# EAGLE design eZ-FET lite (EAGLE 6.4)

## Sheet 1 of 2
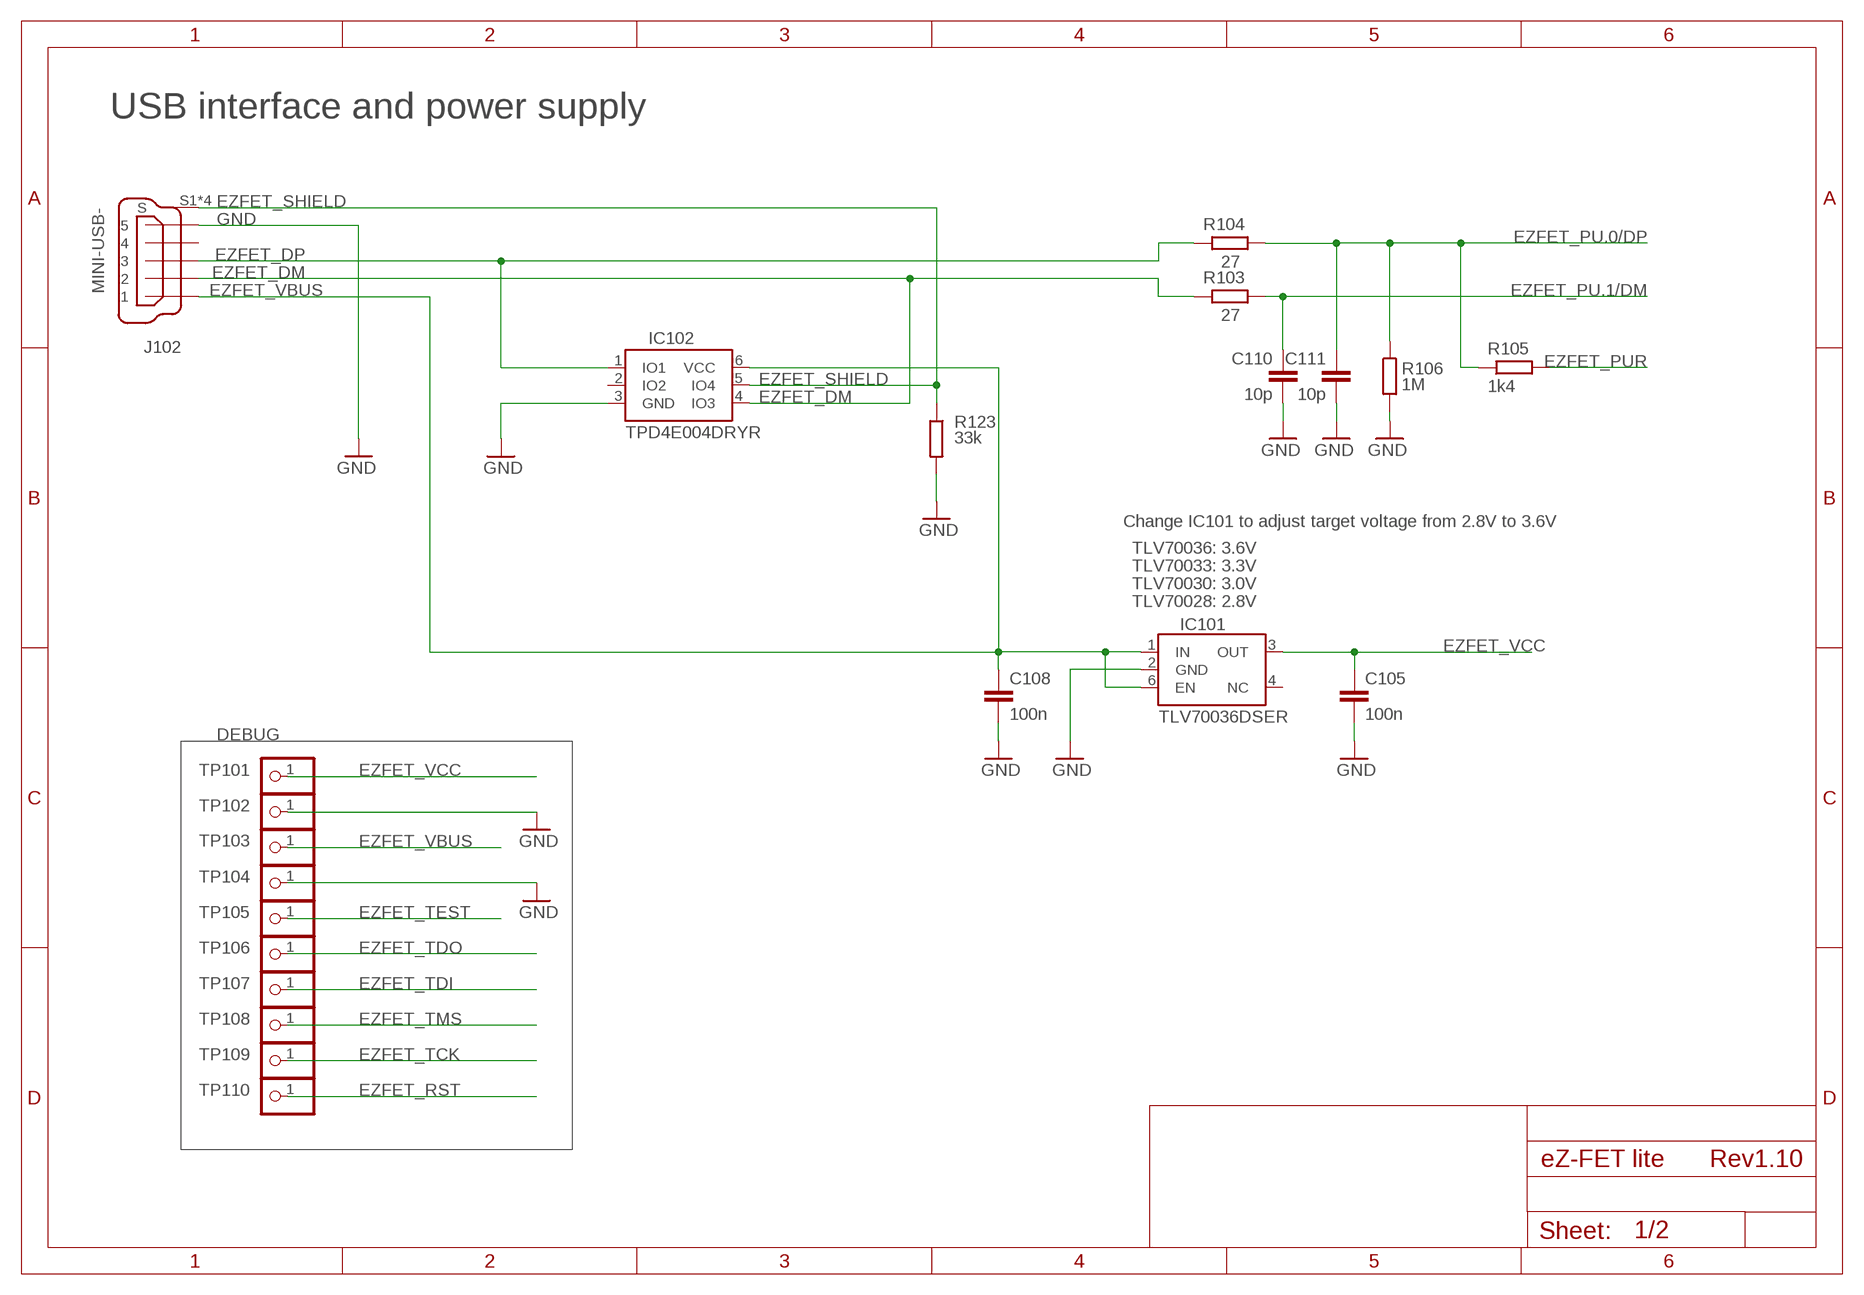
[diagram p0: schematic, sheet 1]

### Parts
C105  100n  C-EUC0402  [C0402]
C108  100n  C-EUC0402  [C0402]
C110  10p  C-EUC0402  [C0402]
C111  10p  C-EUC0402  [C0402]
IC101  TLV70036DSER  TLV700XX  [SON(DRY)6]
IC102  TPD4E004DRYR  TPD4E004  [SON(DRY)6]
J102  MINI-USB-  [UX62M-B-5P]
R103  27  R-EU_R0402  [R0402]
R104  27  R-EU_R0402  [R0402]
R105  1k4  R-EU_R0402  [R0402]
R106  1M  R-EU_R0402  [R0402]
R123  33k  R-EU_R0402  [R0402]
TP101  TEST_PIN2  PINHD-1X1  [1X01]
TP102  TEST_PIN2  PINHD-1X1  [1X01]
TP103  TEST_PIN2  PINHD-1X1  [1X01]
TP104  TEST_PIN2  PINHD-1X1  [1X01]
TP105  TEST_PIN2  PINHD-1X1  [1X01]
TP106  TEST_PIN2  PINHD-1X1  [1X01]
TP107  TEST_PIN2  PINHD-1X1  [1X01]
TP108  TEST_PIN2  PINHD-1X1  [1X01]
TP109  TEST_PIN2  PINHD-1X1  [1X01]
TP110  TEST_PIN2  PINHD-1X1  [1X01]

### Nets
EZFET_DM: IC102.4(IO3) J102.2 R103.1
EZFET_DP: IC102.1(IO1) J102.3 R104.1
EZFET_PU.0/DP: C111.1 R104.2 R105.1 R106.1 ; also sheet 2
EZFET_PU.1/DM: C110.1 R103.2 ; also sheet 2
EZFET_PUR: R105.2 ; also sheet 2
EZFET_RST: TP110.1 ; also sheet 2
EZFET_SHIELD: IC102.5(IO4) J102.S1(S) J102.S2(S) J102.S3(S) J102.S4(S) R123.1
EZFET_TCK: TP109.1 ; also sheet 2
EZFET_TDI: TP107.1 ; also sheet 2
EZFET_TDO: TP106.1 ; also sheet 2
EZFET_TEST: TP105.1 ; also sheet 2
EZFET_TMS: TP108.1 ; also sheet 2
EZFET_VBUS: C108.1 IC101.1(IN) IC101.6(EN) IC102.6(VCC) J102.1 TP103.1 ; also sheet 2
EZFET_VCC: C105.1 IC101.3(OUT) TP101.1 ; also sheet 2
GND: C105.2 C108.2 C110.2 C111.2 IC101.2(GND) IC102.3(GND) J102.5 R106.2 R123.2 TP102.1 TP104.1 ; also sheet 2
Unconnected: IC101.4(NC) IC102.2(IO2) J102.4

### Notes on the sheet
- USB interface and power supply
- Change IC101 to adjust target voltage from 2.8V to 3.6V
- TLV70036: 3.6V
- TLV70033: 3.3V
- TLV70030: 3.0V
- TLV70028: 2.8V
- DEBUG
- Rev1.10

## Sheet 2 of 2
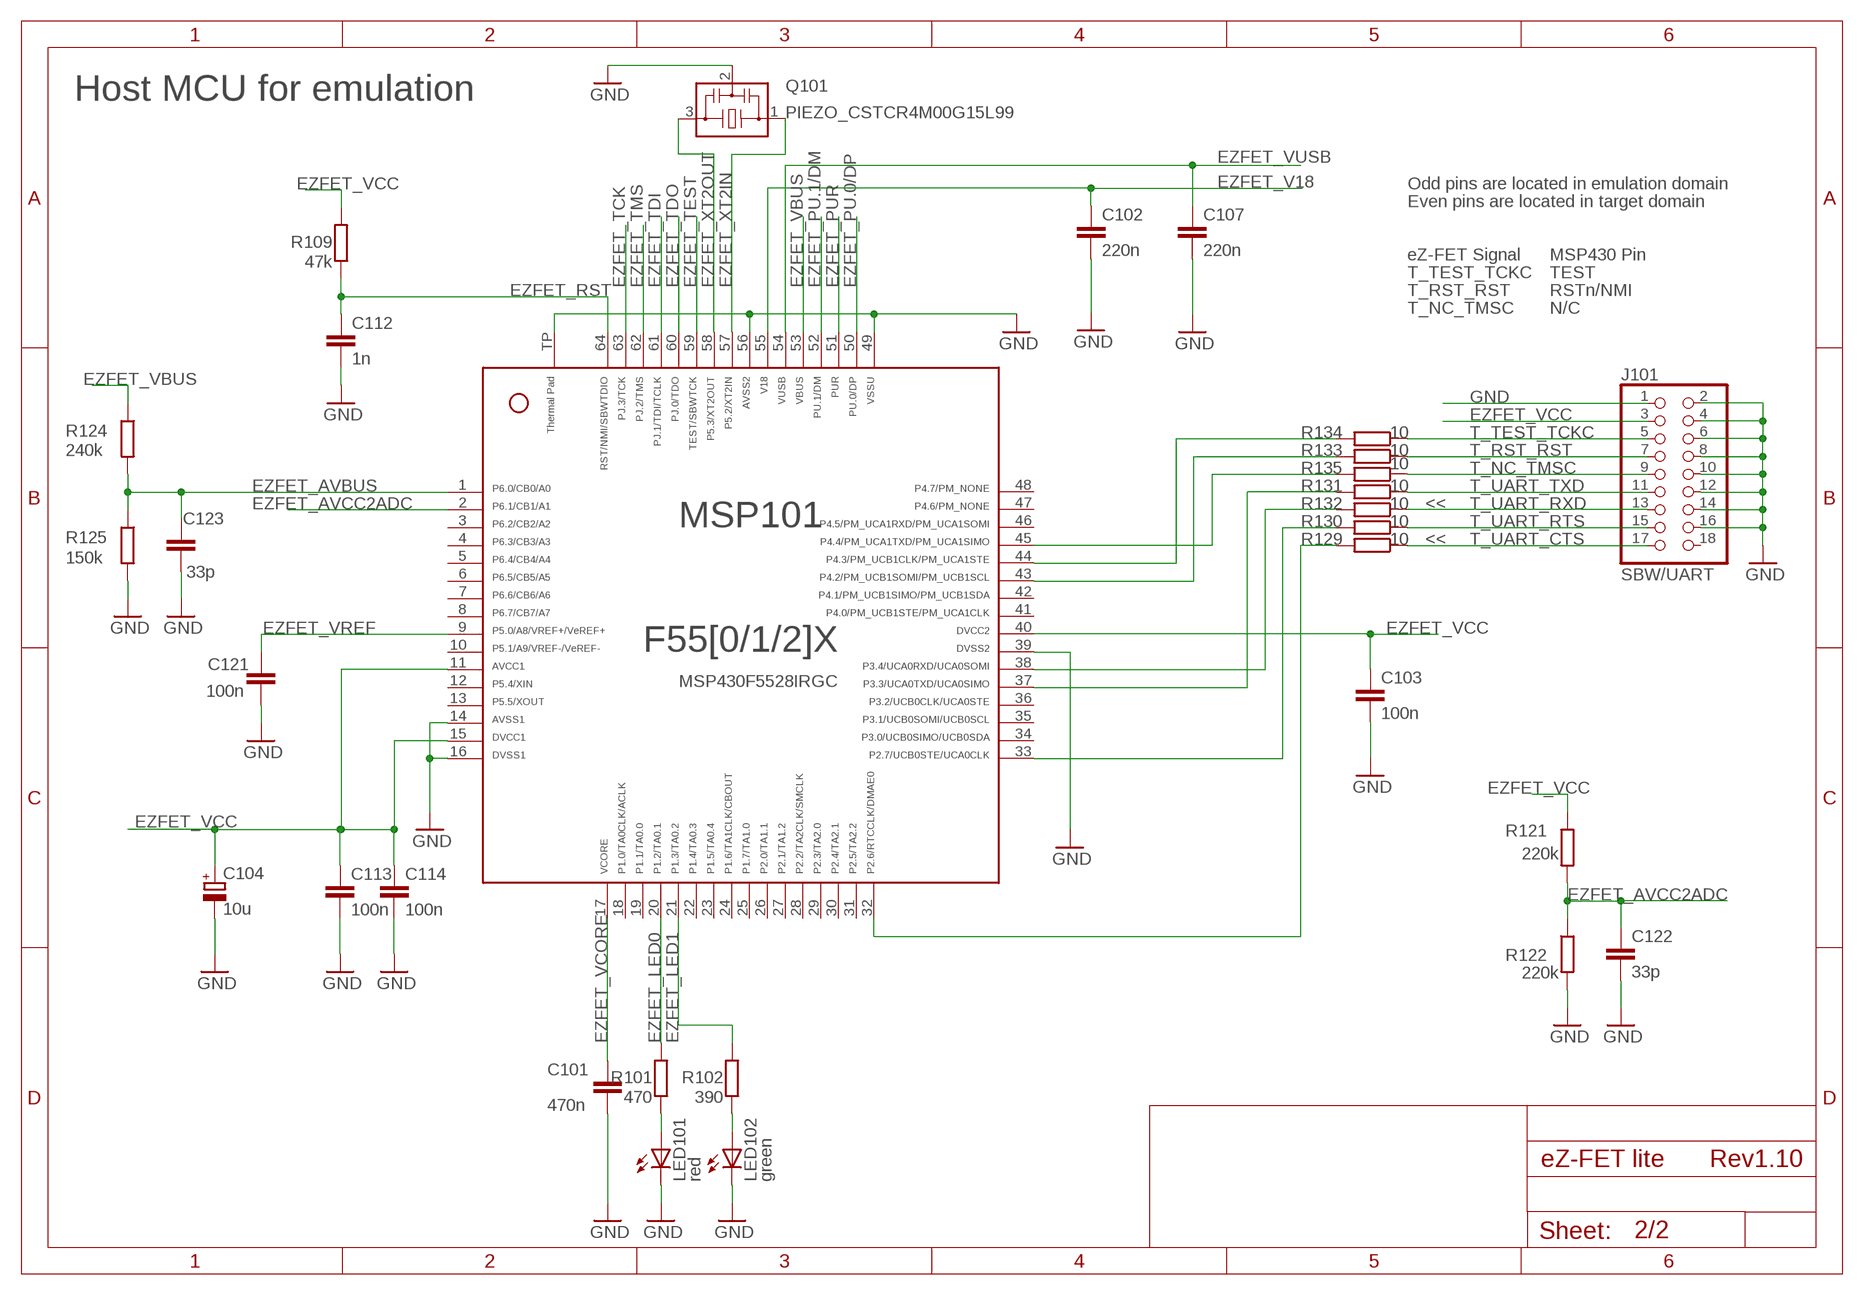
[diagram p1: schematic, sheet 2]

### Parts
C101  470n  C-EUC0402  [C0402]
C102  220n  C-EUC0402  [C0402]
C103  100n  C-EUC0402  [C0402]
C104  10u  CPOL-EUA/3216-18R  [A/3216-18R]
C107  220n  C-EUC0402  [C0402]
C112  1n  C-EUC0402  [C0402]
C113  100n  C-EUC0402  [C0402]
C114  100n  C-EUC0402  [C0402]
C121  100n  C-EUC0402  [C0402]
C122  33p  C-EUC0402  [C0402]
C123  33p  C-EUC0402  [C0402]
J101  SBW/UART  PINHD-2X9  [2X09]
LED101  red  LEDCHIP-LED0603  [CHIP-LED0603]
LED102  green  LEDCHIP-LED0603  [CHIP-LED0603]
MSP101  MSP430F5528IRGC  F55[0/1/2]X---RGC64  [RGC64]
Q101  PIEZO_CSTCR4M00G15L99  CSTCR6M00G53Z  [CSTCR6M]
R101  470  R-EU_R0402  [R0402]
R102  390  R-EU_R0402  [R0402]
R109  47k  R-EU_R0402  [R0402]
R121  220k  R-EU_R0402  [R0402]
R122  220k  R-EU_R0402  [R0402]
R124  240k  R-EU_R0402  [R0402]
R125  150k  R-EU_R0402  [R0402]
R129  10  R-EU_R0402  [R0402]
R130  10  R-EU_R0402  [R0402]
R131  10  R-EU_R0402  [R0402]
R132  10  R-EU_R0402  [R0402]
R133  10  R-EU_R0402  [R0402]
R134  10  R-EU_R0402  [R0402]
R135  10  R-EU_R0402  [R0402]

### Nets
EZFET_AVBUS: C123.2 MSP101.1 R124.2 R125.1
EZFET_AVCC2ADC: C122.2 MSP101.2 R121.2 R122.1
EZFET_LED0: MSP101.20 R101.2
EZFET_LED1: MSP101.21 R102.2
EZFET_PU.0/DP: MSP101.50 ; also sheet 1
EZFET_PU.1/DM: MSP101.52 ; also sheet 1
EZFET_PUR: MSP101.51 ; also sheet 1
EZFET_RST: C112.1 MSP101.64 R109.1 ; also sheet 1
EZFET_SBWTCK: MSP101.44 R134.2
EZFET_SBWTDIO: MSP101.43 R133.2
EZFET_TCK: MSP101.63 ; also sheet 1
EZFET_TDI: MSP101.61 ; also sheet 1
EZFET_TDO: MSP101.60 ; also sheet 1
EZFET_TEST: MSP101.59 ; also sheet 1
EZFET_TMS: MSP101.62 ; also sheet 1
EZFET_UARTCTS: MSP101.32 R129.2
EZFET_UARTRTS: MSP101.33 R130.2
EZFET_UARTRXD: MSP101.38 R132.2
EZFET_UARTTXD: MSP101.37 R131.2
EZFET_V18: C102.1 MSP101.55
EZFET_VBUS: MSP101.53 R124.1 ; also sheet 1
EZFET_VCC: C103.1 C104.+ C113.1 C114.1 J101.3 MSP101.11 MSP101.15 MSP101.40 R109.2 R121.1 ; also sheet 1
EZFET_VCORE: C101.1 MSP101.17
EZFET_VREF: C121.1 MSP101.9
EZFET_VUSB: C107.1 MSP101.54
EZFET_XT2IN: MSP101.57 Q101.1
EZFET_XT2OUT: MSP101.58 Q101.3
GND: C101.2 C102.2 C103.2 C104.- C107.2 C112.2 C113.2 C114.2 C121.2 C122.1 C123.1 J101.1 J101.2 J101.4 J101.6 J101.8 J101.10 J101.12 J101.14 J101.16 LED101.C LED102.C MSP101.14 MSP101.16 MSP101.39 MSP101.49 MSP101.56 MSP101.TP Q101.2 R122.2 R125.2 ; also sheet 1
N$1: LED101.A R101.1
N$2: LED102.A R102.1
N$3: MSP101.45 R135.2
T_NC_TMSC: J101.9 R135.1
T_RST_RST: J101.7 R133.1
T_TEST_TCKC: J101.5 R134.1
T_UART_CTS: J101.17 R129.1
T_UART_RTS: J101.15 R130.1
T_UART_RXD: J101.13 R132.1
T_UART_TXD: J101.11 R131.1
Unconnected: J101.18 MSP101.3 MSP101.4 MSP101.5 MSP101.6 MSP101.7 MSP101.8 MSP101.10 MSP101.12 MSP101.13 MSP101.18 MSP101.19 MSP101.22 MSP101.23 MSP101.24 MSP101.25 MSP101.26 MSP101.27 MSP101.28 MSP101.29 MSP101.30 MSP101.31 MSP101.34 MSP101.35 MSP101.36 MSP101.41 MSP101.42 MSP101.46 MSP101.47 MSP101.48

### Notes on the sheet
- Host MCU for emulation
- Odd pins are located in emulation domain
- Even pins are located in target domain
- eZ-FET Signal | MSP430 Pin
- T_TEST_TCKC | TEST
- T_RST_RST | RSTn/NMI
- T_NC_TMSC | N/C
- <<
- <<
- MSP430F5528IRGC
- Rev1.10

## Library data of the parts
C101-C103 C105 C107 C108 C110-C114 C121-C123 = rcl:C-EU: CAPACITOR, European symbol
C104 = rcl:CPOL-EU: POLARIZED CAPACITOR, European symbol
IC101 = eZFET:TLV700XX
IC102 = eZFET:TPD4E004
J101 = pinhead:PINHD-2X9: PIN HEADER
J102 = eZFET:MINI-USB-: MINI USB Connector Source: http://www.hirose.co.jp/cataloge_hp/e24000019.pdf
LED101 LED102 = led:LED: LED OSRAM: - CHIPLED LG R971, LG N971, LY N971, LG Q971, LY Q971, LO R971, LY R971 LH N974, LH R974 LS Q976, LO Q976, LY Q976 LO Q996 - Hyper CHIPLED LW Q18S LB Q993, LB Q99A, LB R99A - SideLED LS A670, LO A670, LY A670, LG A670, LP A670 LB A673, LV A673, LT A673, LW A673 LH A674 LY A675 LS A676, LA A676, LO A676, LY A676, LW A676 LS A679, LY A679, LG A679 - Hyper Micro SIDELED® LS Y876, LA Y876, LO Y876, LY Y876 LT Y87S - SmartLED LW L88C, LW L88S LB L89C, LB L89S, LG L890 LS L89K, LO L89K, LY L89K LS L896, LA L896, LO L896, LY L896 - TOPLED LS T670, LO T670, LY T670, LG T670, LP T670 LSG T670, LSP T670, LSY T670, LOP T670, LYG T670 LG T671, LOG T671, LSG T671 LB T673, LV T673, LT T673, LW T673 LH T674 LS T676, LA T676, LO T676, LY T676, LB T676, LH T676, LSB T676, LW T676 LB T67C, LV T67C, LT T67C, LS T67K, LO T67K, LY T67K, LW E67C LS E67B, LA E67B, LO E67B, LY E67B, LB E67C, LV E67C, LT E67C LW T67C LS T679, LY T679, LG T679 LS T770, LO T770, LY T770, LG T770, LP T770 LB T773, LV T773, LT T773, LW T773 LH T774 LS E675, LA E675, LY E675, LS T675 LS T776, LA T776, LO T776, LY T776, LB T776 LHGB T686 LT T68C, LB T68C - Hyper Mini TOPLED® LB M676 - Mini TOPLED Santana® LG M470 LS M47K, LO M47K, LY M47K Source: http://www.osram.convergy.de LUXEON: - LUMILED® LXK2-PW12-R00, LXK2-PW12-S00, LXK2-PW14-U00, LXK2-PW14-V00 LXK2-PM12-R00, LXK2-PM12-S00, LXK2-PM14-U00 LXK2-PE12-Q00, LXK2-PE12-R00, LXK2-PE12-S00, LXK2-PE14-T00, LXK2-PE14-U00 LXK2-PB12-K00, LXK2-PB12-L00, LXK2-PB12-M00, LXK2-PB14-N00, LXK2-PB14-P00, LXK2-PB14-Q00 LXK2-PR12-L00, LXK2-PR12-M00, LXK2-PR14-Q00, LXK2-PR14-R00 LXK2-PD12-Q00, LXK2-PD12-R00, LXK2-PD12-S00 LXK2-PH12-R00, LXK2-PH12-S00 LXK2-PL12-P00, LXK2-PL12-Q00, LXK2-PL12-R00 Source: www.luxeon.com KINGBRIGHT: KA-3528ASYC Source: www.kingbright.com
MSP101 = TI_MSP430_v16:F55[0/1/2]X---RGC64: ***F55[0/1/2]X***RGC64 Rev. 1.0 06/2010 "http://www.ti.com/lit/gpn/msp430f5529" "http://www.ti.com/lit/gpn/msp430f5509" F5513/F5514 with limited Functions on some Pins
Q101 = murata-filter:CSTCR: Resonator Source: murata.co.jp; MPN: CSTCR6M00G53-R0; OC_FARNELL: 1170434; OC_NEWARK: 25M8759
R101-R106 R109 R121-R125 R129-R135 = rcl:R-EU_: RESISTOR, European symbol
TP101-TP110 = pinhead:PINHD-1X1: PIN HEADER

## Board
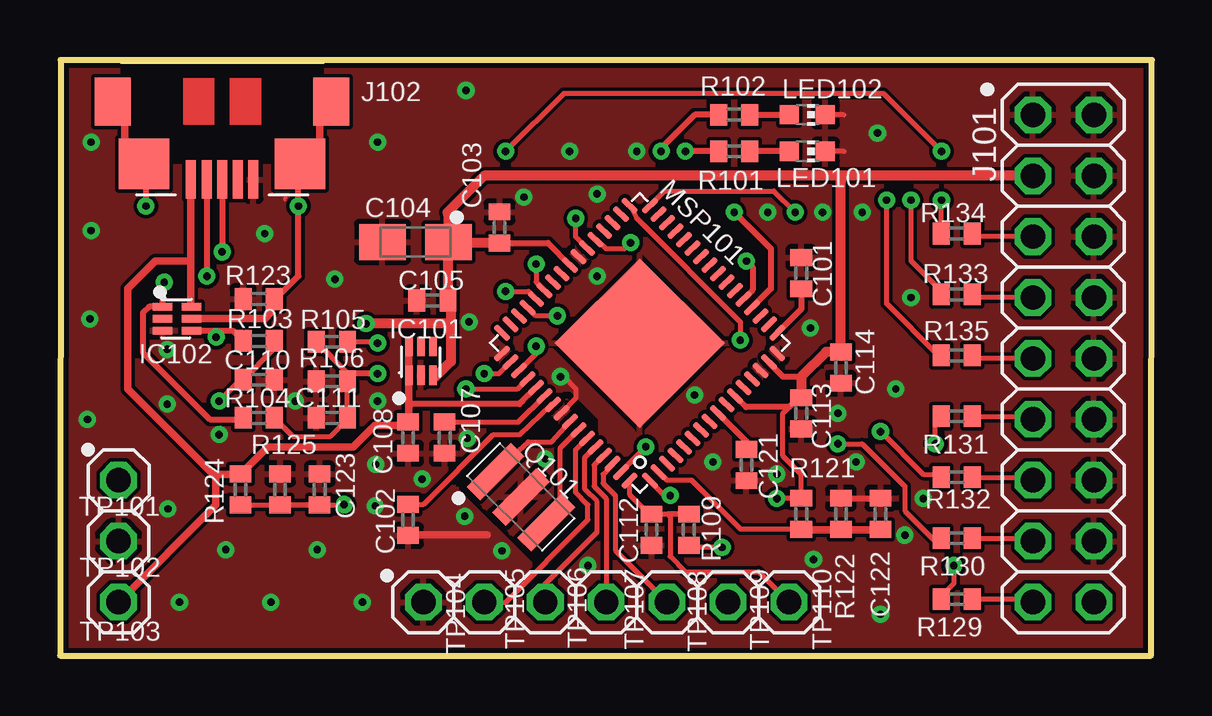
[diagram p2: board, top side]
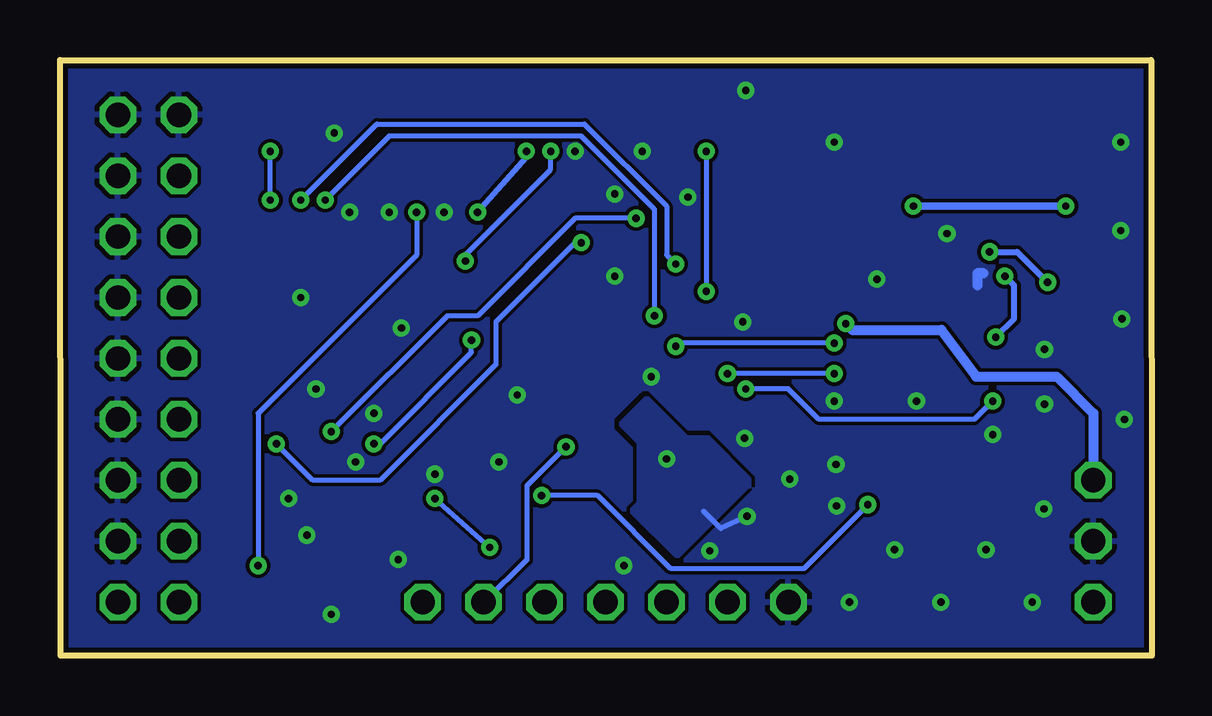
[diagram p3: board, bottom side, seen from below]

Size 45.49 x 24.84 mm. Coordinates in mm from the lower left corner, seen from the top.
Outline: 0,0 45.47,0 45.49,24.84 0.03,24.84 0,0
Copper layers (1*16): Top 0.0178mm / dielectric 12mil / Bottom 0.0178mm
Design rules "default": minimum track width 6mil, minimum drill 12mil, track to track 6mil, track to pad 6mil, pad to pad 6mil, via to via 8mil, smd to smd 6mil, copper to edge 8mil, drill to drill 8mil, minimum pad ring 10mil, minimum via ring 8mil, stop-mask expansion 8mil, vias tented up to drill 15mil, thermal gap 8mil
tRestrict: area 16.5,3.9 to 22.4,11
bRestrict: area 16.5,3.9 to 22.4,11

### Footprints (pad centres in the part's own frame; a part is rotated, then mirrored left to right if it is on the bottom)
C0402 = smd 0.7 x 0.9: 1 -0.65,0; 2 0.65,0
A/3216-18R = smd 1.95 x 1.5: + 1.375,0; - -1.375,0
SON(DRY)6 = smd 0.81 x 0.305: 1 -0.1,0; 2 -0.1,-0.5; 3 -0.1,-1; 4 1.1,-1; 5 1.1,-0.5; 6 1.1,0
2X09 = drill 1.016 octagon: 1 -10.16,-1.27; 2 -10.16,1.27; 3 -7.62,-1.27; 4 -7.62,1.27; 5 -5.08,-1.27; 6 -5.08,1.27; 7 -2.54,-1.27; 8 -2.54,1.27; 9 0,-1.27; 10 0,1.27; 11 2.54,-1.27; 12 2.54,1.27; 13 5.08,-1.27; 14 5.08,1.27; 15 7.62,-1.27; 16 7.62,1.27; 17 10.16,-1.27; 18 10.16,1.27
UX62M-B-5P = smd 0.42 x 1.6: 1 1.3,1.3; 2 0.65,1.3; 3 0,1.3; 4 -0.65,1.3; 5 -1.3,1.3 | smd 2.1 x 2.1: S1 -3.25,0.65; S2 3.25,0.65 | smd 1.5 x 2: S3 -4.55,-1.95; S4 4.55,-1.95
CHIP-LED0603 = smd 0.8 x 0.8: A 0,-0.75; C 0,0.75
RGC64 = smd 0.825 x 0.28: 1 -4.36,3.75; 2 -4.36,3.25; 3 -4.36,2.75; 4 -4.36,2.25; 5 -4.36,1.75; 6 -4.36,1.25; 7 -4.36,0.75; 8 -4.36,0.25; 9 -4.36,-0.25; 10 -4.36,-0.75; 11 -4.36,-1.25; 12 -4.36,-1.75; 13 -4.36,-2.25; 14 -4.36,-2.75; 15 -4.36,-3.25; 16 -4.36,-3.75; 33 4.36,-3.75; 34 4.36,-3.25; 35 4.36,-2.75; 36 4.36,-2.25; 37 4.36,-1.75; 38 4.36,-1.25; 39 4.36,-0.75; 40 4.36,-0.25; 41 4.36,0.25; 42 4.36,0.75; 43 4.36,1.25; 44 4.36,1.75; 45 4.36,2.25; 46 4.36,2.75; 47 4.36,3.25; 48 4.36,3.75 | smd 0.28 x 0.825: 17 -3.75,-4.36; 18 -3.25,-4.36; 19 -2.75,-4.36; 20 -2.25,-4.36; 21 -1.75,-4.36; 22 -1.25,-4.36; 23 -0.75,-4.36; 24 -0.25,-4.36; 25 0.25,-4.36; 26 0.75,-4.36; 27 1.25,-4.36; 28 1.75,-4.36; 29 2.25,-4.36; 30 2.75,-4.36; 31 3.25,-4.36; 32 3.75,-4.36; 49 3.75,4.36; 50 3.25,4.36; 51 2.75,4.36; 52 2.25,4.36; 53 1.75,4.36; 54 1.25,4.36; 55 0.75,4.36; 56 0.25,4.36; 57 -0.25,4.36; 58 -0.75,4.36; 59 -1.25,4.36; 60 -1.75,4.36; 61 -2.25,4.36; 62 -2.75,4.36; 63 -3.25,4.36; 64 -3.75,4.36 | smd 5 x 5: TP 0,0
CSTCR6M = smd 0.8 x 2.6: 1 -1.5,0; 2 0,0; 3 1.5,0
R0402 = smd 0.7 x 0.9: 1 -0.65,0; 2 0.65,0
1X01 = drill 1.016 octagon: 1 0,0

### Placement (x,y rotation side)
C101  30.89,15.95 90 top
C102  14.5,5.66 270 top
C103  18.31,17.86 90 top
C104  14.81,17.25 0 top
C105  15.52,14.81 180 top
C107  16.03,9.09 270 top
C108  14.5,9.09 270 top
C110  8.28,11.51 0 top
C111  11.33,9.92 180 top
C112  24.65,5.25 270 top
C113  30.89,10.11 270 top
C114  32.54,12.01 270 top
C121  28.6,7.95 270 top
C122  34.19,5.92 270 top
C123  10.82,6.93 270 top
IC101  14.54,11.79 90 top
IC102  4.38,14.55 0 top
J101  41.81,12.4 270 top
J102  6.76,21.16 180 top
LED101  31.14,21.03 270 top
LED102  31.14,22.56 270 top
MSP101  24.16,13.03 135 top
Q101  19.2,6.62 315 top
R101  28.09,21.03 180 top
R102  28.09,22.56 180 top
R103  8.28,13.13 0 top
R104  8.28,9.92 0 top
R105  11.33,13.09 0 top
R106  11.33,11.44 180 top
R109  26.2,5.25 270 top
R121  30.89,5.92 270 top
R122  32.54,5.92 90 top
R123  8.28,14.87 180 top
R124  7.52,6.93 270 top
R125  9.17,6.93 90 top
R129  37.36,2.36 180 top
R130  37.36,4.9 180 top
R131  37.36,9.98 180 top
R132  37.36,7.44 180 top
R133  37.36,15.06 180 top
R134  37.36,17.6 180 top
R135  37.36,12.52 180 top
TP101  2.44,7.32 0 top
TP102  2.44,4.78 0 top
TP103  2.44,2.24 0 top
TP104  15.14,2.24 0 top
TP105  17.68,2.24 0 top
TP106  20.22,2.24 0 top
TP107  22.76,2.24 0 top
TP108  25.3,2.24 0 top
TP109  27.84,2.24 0 top
TP110  30.38,2.24 0 top

### Tracks (layer width: path | path; a pad name or v marks a point on that pad's centre or on a via)
EZFET_AVBUS  (via drill 0.3)
  Top 0.203: v25.43,6.68 25.17,6.68 24.59,7.26 MSP101.1 | R124.2 9.15,6.28 9.17,6.3 9.3,6.3 9.31,6.28 C123.2 | R125.1 C123.2 | C123.2 | C123.2 11.82,6.28 v11.84,6.3
  Bottom 0.203: v25.43,6.68 23.09,6.68 20.04,3.63 14.5,3.63 v11.84,6.3
EZFET_AVCC2ADC
  Top 0.152: 30.89,5.28 R121.2
  Top 0.203: MSP101.2 25.02,7.57 25.04,7.57 25.3,7.32 26.31,7.32 28.35,5.28 30.89,5.28
  Top 0.305: C122.2 R122.1 32.41,5.26 R121.2
EZFET_DM  (via drill 0.3)
  Top 0.254: R103.1 7.2,13.55 IC102.4 6.23,13.55 v6.5,13.28 | J102.2 6.11,19.78 v6.12,15.82
  Bottom 0.254: v6.5,13.28 5.74,14.05 5.74,15.44 v6.12,15.82
EZFET_DP  (via drill 0.3)
  Top 0.254: J102.3 v6.76,16.84 | v4.34,15.57 4.28,15.5 IC102.1 3.71,14.55 3.45,14.3 3.45,12.65 6.25,9.86 7.57,9.86 R104.1
  Bottom 0.254: v6.76,16.84 5.61,16.84 v4.34,15.57
EZFET_LED0  (via drill 0.3)
  Top 0.254: R101.2 v26.06,21.03 | v28.09,18.49 29.62,16.97 29.62,15.31 MSP101.20
  Bottom 0.254: v26.06,21.03 26.06,20.78 v28.09,18.49
EZFET_LED1  (via drill 0.3)
  Top 0.254: R102.2 26.44,22.56 25.04,21.16 v25.04,21.03 | v28.6,16.46 28.85,16.21 28.85,15.25 MSP101.21
  Bottom 0.203: v28.6,16.46 28.6,16.71 25.04,20.27 v25.04,21.03
EZFET_PU.0/DP  (via drill 0.3)
  Top 0.203: MSP101.50 18.29,11.76 v17.68,11.76 | C111.1 12.03,10.05 | R105.1 11.98,11.79 R106.1 | R106.1 | C111.1 R106.1 | C111.1 11.98,10 | R104.2 9.71,9.14 11.28,9.14 11.98,9.85 C111.1
  Top 0.254: v13.23,11.76 11.98,11.76 11.98,11.79
  Bottom 0.203: v13.23,11.76 v17.68,11.76
EZFET_PU.1/DM  (via drill 0.3)
  Top 0.203: R103.2 8.93,12.81 C110.1 7.52,11.51 v6.63,10.62 | MSP101.52 19.07,11.13 v16.92,11.13
  Bottom 0.203: v16.92,11.13 15.14,11.13 13.87,9.86 7.39,9.86 v6.63,10.62
EZFET_PUR  (via drill 0.3)
  Top 0.203: MSP101.51 19.58,12.35 19.84,12.6 v19.84,12.9 | v13.23,13.03 13.17,13.09 R105.2
  Bottom 0.203: v13.23,13.03 19.71,13.03 v19.84,12.9
EZFET_RST
  Top 0.203: MSP101.64 23.72,6.73 24.54,5.92 24.53,5.92 C112.1 R109.1 25.31,5.9 25.43,5.79 25.43,4.14 26.06,3.51 29.11,3.51 TP110.1
EZFET_SBWTCK  (via drill 0.3)
  Top 0.203: R134.2 36.71,18.98 v36.73,19 | v36.73,21.03 34.32,23.44 20.98,23.44 v18.57,21.03 | v18.57,15.19 19.52,15.19 MSP101.44
  Bottom 0.203: v36.73,19 v36.73,21.03 | v18.57,21.03 v18.57,15.19
EZFET_SBWTDIO  (via drill 0.3)
  Top 0.203: R133.2 36.71,15.2 35.46,16.46 v35.46,19 | v19.84,16.33 19.84,15.58 MSP101.43
  Bottom 0.203: v19.84,16.33 20.22,16.71 20.22,18.75 23.65,22.17 32.28,22.17 v35.46,19
EZFET_SHIELD  (via drill 0.3)
  Top 0.152: 3.2,20.27 3.48,20.27 J102.S2 | 10.06,20.27 10.06,19.76
  Top 0.254: R123.1 8.98,14.87 9.93,15.82 v9.93,18.75 9.93,19.63 10.06,19.76 | J102.S3 11.33,23.11 | J102.S4 2.18,23.11 | J102.S2 3.58,20.51 v3.58,18.75
  Top 0.305: IC102.5 8.53,14.05 8.79,14.3 8.79,14.73 R123.1 | 2.69,21.29 2.69,22.81 2.18,22.81 2.18,23.06 2.21,23.06 J102.S4 | J102.S3 11.31,22.81 10.82,22.81 10.82,20.51 J102.S1 10.06,20.51 10.06,20.27
  Top 0.406: 3.2,20.27 2.69,20.27 2.69,21.29
  Bottom 0.305: v3.58,18.75 v9.93,18.75
EZFET_TCK  (via drill 0.3)
  Top 0.203: v24.41,8.71 23.37,7.67 MSP101.63
  Bottom 0.203: v24.41,8.71 26.04,7.09 26.04,3.99 TP109.1 | TP109.1
EZFET_TDI
  Top 0.203: MSP101.61 22.66,8.36 22.25,7.95 22.25,7.06 22.76,6.55 TP107.1 | TP107.1
EZFET_TDO
  Top 0.203: TP106.1 20.22,3 22.38,5.16 22.38,6.43 21.87,6.93 21.87,8.27 MSP101.60
EZFET_TEST
  Top 0.203: TP105.1 18.57,2.24 22,5.66 22,6.3 21.49,6.81 21.49,8.59 22,9.09 21.99,9.09 MSP101.59
EZFET_TMS
  Top 0.203: MSP101.62 23.02,7.96 22.63,7.57 22.63,7.19 23.14,6.68 23.14,4.39 TP108.1
EZFET_UARTCTS  (via drill 0.3)
  Top 0.203: MSP101.32 24.59,18.8 25.17,19.38 29.74,19.38 v30.63,18.49 | v37.24,3.76 37.24,3 36.73,2.49 36.73,2.38 R129.2
  Bottom 0.203: v30.63,18.49 30.63,16.71 37.24,10.11 v37.24,3.76
EZFET_UARTRTS  (via drill 0.3)
  Top 0.152: R130.2 36.7,4.9 36.55,4.75 36.47,4.78
  Top 0.203: MSP101.33 23.75,18.77 23.77,18.75 24.03,18.24 28.35,13.92 v28.35,13.16 | v32.41,8.84 33.43,8.84 35.2,7.06 35.2,6.05 36.47,4.78
  Bottom 0.203: v32.41,8.84 32.16,8.84 28.35,12.65 v28.35,13.16
EZFET_UARTRXD  (via drill 0.3)
  Top 0.152: R132.2 36.73,7.57
  Top 0.203: MSP101.38 21.96,17.01 21.49,17.48 v21.49,18.24 | v34.19,9.35 35.97,7.57 36.73,7.57
  Bottom 0.203: v21.49,18.24 24.03,18.24 28.09,14.17 29.36,14.17 v34.19,9.35
EZFET_UARTTXD  (via drill 0.3)
  Top 0.152: R131.2 36.67,10.05
  Top 0.203: MSP101.37 22.37,17.35 22.76,16.97 23.52,16.97 v23.77,17.22 | v36.47,8.84 36.47,9.86 36.67,10.05 36.73,10.11
  Bottom 0.203: v23.77,17.22 24.03,17.22 27.33,13.92 27.33,12.14 32.16,7.32 34.95,7.32 v36.47,8.84
EZFET_V18
  Top 0.203: MSP101.55 20.46,10.48 19.15,9.22 18.06,9.22 15.15,6.31 C102.1
EZFET_VBUS
  Top 0.203: IC101.6 14.5,12.86 14.5,11.76 | 7.52,7.57 | 7.52,7.57 R124.1 | IC102.6 | IC102.6
  Top 0.254: 19.14,10.49 19.27,10.62 MSP101.53 19.14,10.49 | 19.14,10.49 14.66,10.49 14.54,10.36
  Top 0.305: IC101.6 IC101.1 14.54,10.36 14.54,9.78 C108.1 14.49,9.74 14.38,9.86 14.12,9.6 13.11,9.6 12.22,8.71 8.66,8.71 7.52,7.57 7.01,7.57 6.49,7.55 | TP103.1 6.49,6.28 6.49,7.55 | 6.49,7.55 6.44,7.51 2.82,11.13 2.82,15.32 3.96,16.46 5.46,16.46 | J102.1 5.46,16.46 | 5.46,16.46 5.46,14.58 IC102.6
EZFET_VCC  (via drill 0.3)
  Top 0.152: IC101.3 15.54,11.71 15.65,11.63
  Top 0.203: 30.89,10.87 30.12,10.11 30.12,8.33 30.89,7.57 R121.1 29.89,6.57 v29.87,6.55 | v27.58,4.52 26.28,4.52 R109.2
  Top 0.254: C103.1 20.33,17.21 MSP101.40 | C113.1 30.77,10.76 30.38,10.36 28.59,10.36 MSP101.11 | MSP101.15 29.54,12.22 30.12,11.63 30.89,11.63
  Top 0.305: 16.28,14.68 16.15,14.81 C105.1 | C105.1
  Top 0.406: 16.28,14.68 16.28,13.84 | 16.28,13.84 16.28,12.27 15.65,11.63 | 16.28,13.84 v12.75,13.84 | C105.1 16.17,16.92 C104.+ | C103.1 16.45,17.21 C104.+ | J101.3 32.41,20.02 | 32.41,20.02 17.68,20.02 16.15,18.49 16.18,18.21 C104.+ | C113.1 30.89,10.87 30.89,11.63 31.92,12.66 C114.1 32.54,19.78 arc45 32.46,19.96 32.41,20.02
  Bottom 0.152: 2.41,7.34 2.46,7.34 TP101.1 | v12.75,13.84 12.5,13.59
  Bottom 0.203: v29.87,6.55 v27.58,4.52
  Bottom 0.406: 2.41,7.34 2.49,7.93 2.44,7.93 2.44,10.11 3.96,11.63 7.32,11.63 8.76,13.59 12.5,13.59
EZFET_VCORE
  Top 0.254: C101.1 30.89,14.46 MSP101.17
EZFET_VREF
  Top 0.203: C121.1 28.6,8.94
  Top 0.254: 28.6,8.94 MSP101.9
EZFET_VUSB
  Top 0.203: MSP101.54 19.1,9.74 C107.1
EZFET_XT2IN
  Top 0.203: Q101.1 19.51,8.92 20.5,8.92 21.25,9.74 MSP101.57
EZFET_XT2OUT
  Top 0.203: MSP101.58 20.85,8.67 20.85,6.3 20.26,5.71 Q101.3
GND  (via drill 0.3)
  Top 0.152: 9.37,19.02 9.39,19.1 | 9.39,19.1 9.39,19.11 | 9.39,19.1 9.4,19.1 9.4,19.18 | 8.81,19.25 8.79,19.23 | 29.87,12.65 29.87,12.62 MSP101.16
  Top 0.203: MSP101.56 20.9,10.15 21.49,10.74 21.49,11.13 20.98,11.63 v20.85,11.63 | MSP101.14 29.1,11.89 | 32.66,22.56 32.16,22.56 | 32.66,21.03 31.65,21.03
  Top 0.254: R122.2 34.17,6.57 34.19,6.55
  Top 0.305: 19.2,6.43 Q101.2 | 17.81,5.03 14.52,5.03 C102.2
  Bottom 0.203: 18.67,6.02 17.96,5.31 v16.87,5.82
  Bottom 0.406: 7.01,15.95 7.26,15.95 7.26,15.44
  other vias: 6.63,9.22 4.47,10.49 16.92,23.57 1.14,9.86 4.5,6.12 13.16,7.98 13.13,6.25 18.41,4.37 6.91,4.42 15.09,7.37 16.97,9.07 4.98,2.24 12.6,2.24 1.24,14.05 1.3,17.73 13.23,21.41 1.3,21.41 9.8,10.62 8.53,17.6 4.47,12.78 34.06,21.79 34.82,11.13 29.49,18.49 27.2,8.08 17.04,13.92 20.22,8.2 11.46,15.7 10.72,4.42 31.27,13.67 26.44,10.87 24.03,21.03 13.23,10.62 34.19,1.73 8.79,2.24 31.39,4.01 35.2,5.03 35.97,6.55 33.17,8.08 32.41,10.11 29.87,7.57 33.43,18.49 22.38,19.25 19.33,19.13 21.23,21.03 31.78,18.49 35.46,14.94 22,3.76 22.38,15.82
  pour Bottom: 45.49,0 45.49,24.84 0.03,24.84 0.03,0
  pour Top: -0.03,-0.03 0.03,24.84 45.49,24.84 45.44,-0.03
  pour Bottom: 18.41,9.07 19.46,9.09 21.11,10.72 22.12,9.73 21.36,8.84 21.36,6.43 21.62,6.17 21.62,6.05 19.84,4.14 19.71,4.14 16.79,7.06 16.79,7.44
  pour Top: 19.43,9.02 21.11,10.72 22.12,9.6 21.36,8.84 21.36,6.43 21.62,6.05 19.84,4.14 19.58,4.27 16.79,7.06 16.79,7.44 18.41,9.07
N$1
  Top 0.254: LED101.A R101.1
N$2
  Top 0.203: LED102.A
  Top 0.254: R102.1 LED102.A
N$3  (via drill 0.3)
  Top 0.203: R135.2 36.6,12.52 34.44,14.68 v34.44,19 | v20.73,14.17 19.83,14.17 MSP101.45
  Bottom 0.203: v20.73,14.17 20.73,18.62 23.77,21.67 31.78,21.67 v34.44,19
T_NC_TMSC
  Top 0.203: J101.9 38.14,12.4 | 38,12.4 38.14,12.4 | 38.14,12.4 R135.1
T_RST_RST
  Top 0.203: J101.7 38.14,14.94 R133.1
T_TEST_TCKC
  Top 0.203: J101.5 38,17.48 38,17.59 R134.1
T_UART_CTS
  Top 0.203: R129.1 40.54,2.36 J101.17
T_UART_RTS
  Top 0.203: R130.1 40.54,4.9 J101.15
T_UART_RXD
  Top 0.203: R132.1 40.54,7.44 J101.13
T_UART_TXD
  Top 0.203: R131.1 40.54,9.98 J101.11

### Text on the board
Document: 24.8 mm | 45.6 mm\
tDocu: eZ-FET | lite | rev1.10